# EAGLE design Controller (EAGLE 9.0.0)
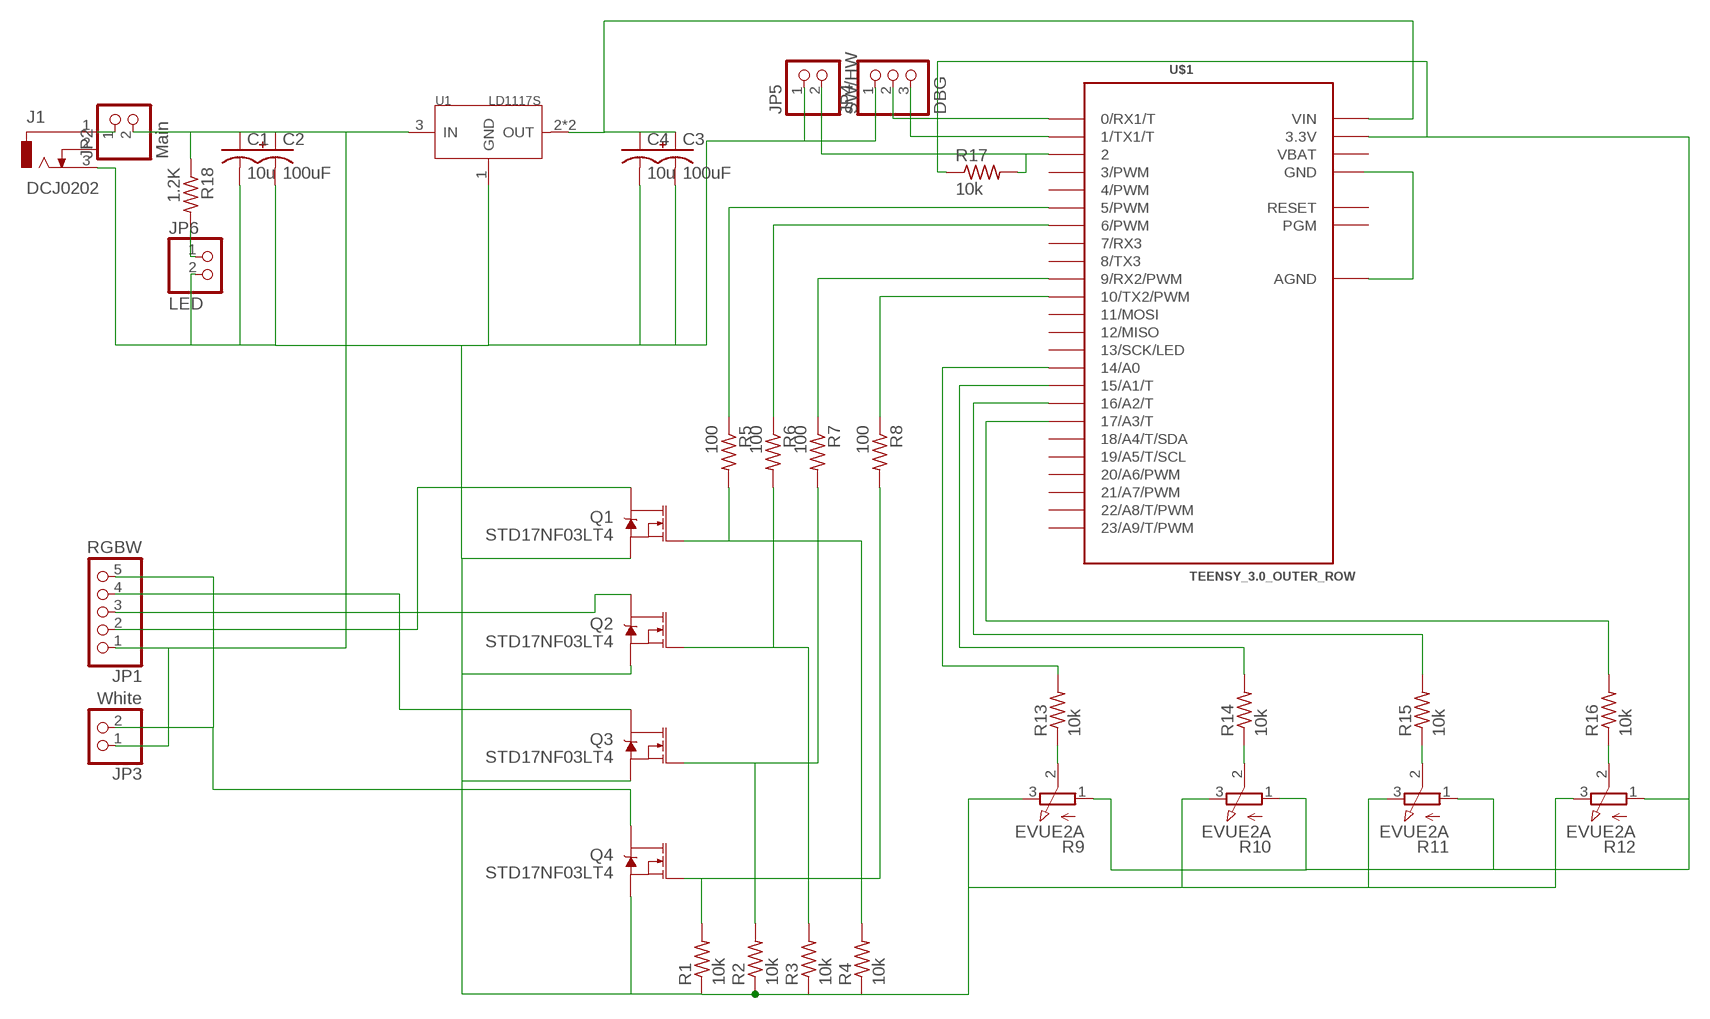
[diagram p0: schematic, sheet 1]

## Parts
C1  10u  ADAFRUIT_C-USC0805  [ADAFRUIT_C0805]
C2  100uF  RCL_CPOL-USTT2D6  [RCL_TT2D6]
C3  100uF  RCL_CPOL-USTT2D6  [RCL_TT2D6]
C4  10u  ADAFRUIT_C-USC0805  [ADAFRUIT_C0805]
J1  DCJ0202  [DCJ0202]
JP1  RGBW  PINHD-1X5/90  [1X05/90]
JP2  Main  PINHD-1X2  [1X02]
JP3  White  PINHD-1X2/90  [1X02/90]
JP4  DBG  PINHD-1X3/90  [1X03/90]
JP5  SW/HW  PINHD-1X2  [1X02]
JP6  LED  PINHD-1X2  [1X02]
Q1  STD17NF03LT4  MOSFET-NCH-FDD8780  [DPAK]
Q2  STD17NF03LT4  MOSFET-NCH-FDD8780  [DPAK]
Q3  STD17NF03LT4  MOSFET-NCH-FDD8780  [DPAK]
Q4  STD17NF03LT4  MOSFET-NCH-FDD8780  [DPAK]
R1  10k  R-US_R0805  [R0805]
R2  10k  R-US_R0805  [R0805]
R3  10k  R-US_R0805  [R0805]
R4  10k  R-US_R0805  [R0805]
R5  100  R-US_R0805  [R0805]
R6  100  R-US_R0805  [R0805]
R7  100  R-US_R0805  [R0805]
R8  100  R-US_R0805  [R0805]
R9  EVUE2A  [EVUE]
R10  EVUE2A  [EVUE]
R11  EVUE2A  [EVUE]
R12  EVUE2A  [EVUE]
R13  10k  R-US_R0805  [R0805]
R14  10k  R-US_R0805  [R0805]
R15  10k  R-US_R0805  [R0805]
R16  10k  R-US_R0805  [R0805]
R17  10k  R-US_R0805  [R0805]
R18  1.2K  R-US_R0805  [R0805]
U1  LD1117S  [SOT-223]
U$1  TEENSY_3.0_OUTER_ROW  [TEENSY_3.0-3.2&LC_OUTER_ROW]

## Nets
GND: C1.2 C2.- C3.- C4.2 J1.3 JP4.1 JP5.1 JP6.2 Q1.3(S) Q2.3(S) Q3.3(S) Q4.3(S) R1.1 R2.1 R3.1 R4.1 R9.3(E) R10.3(E) R11.3(E) R12.3(E) U1.1(GND)
N$1 [LED_Power]: C1.1 C2.+ JP1.1 JP2.2 JP3.1 R18.1 U1.3(IN)
N$2 [3.3vPower]: C3.+ C4.1 U1.2(OUT) U1.TER(OUT) U$1.VIN
N$3: R5.1 U$1.5(5/PWM)
N$4: Q4.1(G) R1.2 R8.2
N$5: Q3.1(G) R2.2 R7.2
N$6: Q2.1(G) R3.2 R6.2
N$7: Q1.1(G) R4.2 R5.2
N$8: R6.1 U$1.6(6/PWM)
N$9: R7.1 U$1.9(9/RX2/PWM)
N$10: R8.1 U$1.10(10/TX2/PWM)
N$11: R9.2(S) R13.1
N$12 [LED_Power]: JP1.2 Q1.4(D)
N$13 [LED_Power]: JP1.3 Q2.4(D)
N$14 [LED_Power]: JP1.4 Q3.4(D)
N$15 [LED_Power]: JP1.5 JP3.2 Q4.4(D)
N$16 [LED_Power]: J1.1 JP2.1
N$17: R10.2(S) R14.1
N$18: R11.2(S) R15.1
N$19: R12.2(S) R16.1
N$20: R9.1(A) R10.1(A) R11.1(A) R12.1(A) R17.1 U$1.3.3V U$1.3.3V1(3.3V)
N$21: R13.2 U$1.14/A0
N$22: R14.2 U$1.15/A1(15/A1/T)
N$23: R15.2 U$1.16/A2(16/A2/T)
N$24: R16.2 U$1.17/A3(17/A3/T)
N$25: U$1.AGND
N$26: JP5.2 R17.2 U$1.2
N$27: JP4.2 U$1.0(0/RX1/T)
N$28: JP4.3 U$1.1(1/TX1/T)
N$29: JP6.1 R18.2
Unconnected: J1.2 U$1.3(3/PWM) U$1.4(4/PWM) U$1.7(7/RX3) U$1.8(8/TX3) U$1.11(11/MOSI) U$1.12(12/MISO) U$1.13(13/SCK/LED) U$1.18/A4(18/A4/T/SDA) U$1.19/A5(19/A5/T/SCL) U$1.20/A6(20/A6/PWM) U$1.21/A7(21/A7/PWM) U$1.22/A8(22/A8/T/PWM) U$1.23/A9(23/A9/T/PWM) U$1.PGM U$1.RESET/DAC(RESET)

## Power pins joined to a net without a drawn wire
GND: U$1.GND U$1.GND1(GND)
VBAT: U$1.VBAT

## Library data of the parts
C1 C4 = schematic:ADAFRUIT_C-US: CAPACITOR, American symbol
C2 C3 = schematic:RCL_CPOL-US: POLARIZED CAPACITOR, American symbol
J1 = con-jack:DCJ0202: DC POWER JACK Source: DCJ0202.pdf; OC_FARNELL: unknown; OC_NEWARK: unknown
JP1 = pinhead:PINHD-1X5: PIN HEADER
JP2 JP3 JP5 JP6 = pinhead:PINHD-1X2: PIN HEADER
JP4 = pinhead:PINHD-1X3: PIN HEADER
Q1-Q4 = SparkFun-DiscreteSemi:MOSFET-NCH: N-channel MOSFETs Voltage controlled devices that allow control of high current outputs. SparkFun Products: SparkFun OpenScale <https://www.sparkfun.com/products/13261> SparkFun Digital Sandbox <https://www.sparkfun.com/products/12651> SparkFun Monster Moto Shield <https://www.sparkfun.com/products/10182> SparkFun MOSFET Power Controller <https://www.sparkfun.com/products/11214>; PROD_ID: TRANS-09984; VALUE: 35A/25V/8.5mΩ
R1-R8 R13-R18 = rcl:R-US_: RESISTOR, American symbol
R9-R12 = pot:EVU: 9 mm Square Rotary Potentiometers Source: Panasonic
U1 = IC:LD1117: Low Drop Fixed And Adjustable Positive Voltage Regulators http://www.datasheetcatalog.org/datasheet/SGSThomsonMicroelectronics/mXuqtqv.pdf
U$1 = Teensy_3_and_LC_Series_Boards_v1.4:TEENSY_3.0_OUTER_ROW: Basic Teensy 3.0 with none of the 'inner' pins enabled. See 'DIL+4', and other packages for additional pin holes, as needed.

## Net classes
2 LED_Power: width 2.032 mm, drill 0.508 mm, clearance 0.127 mm
3 3.3vPower: width 0.508 mm

## Board
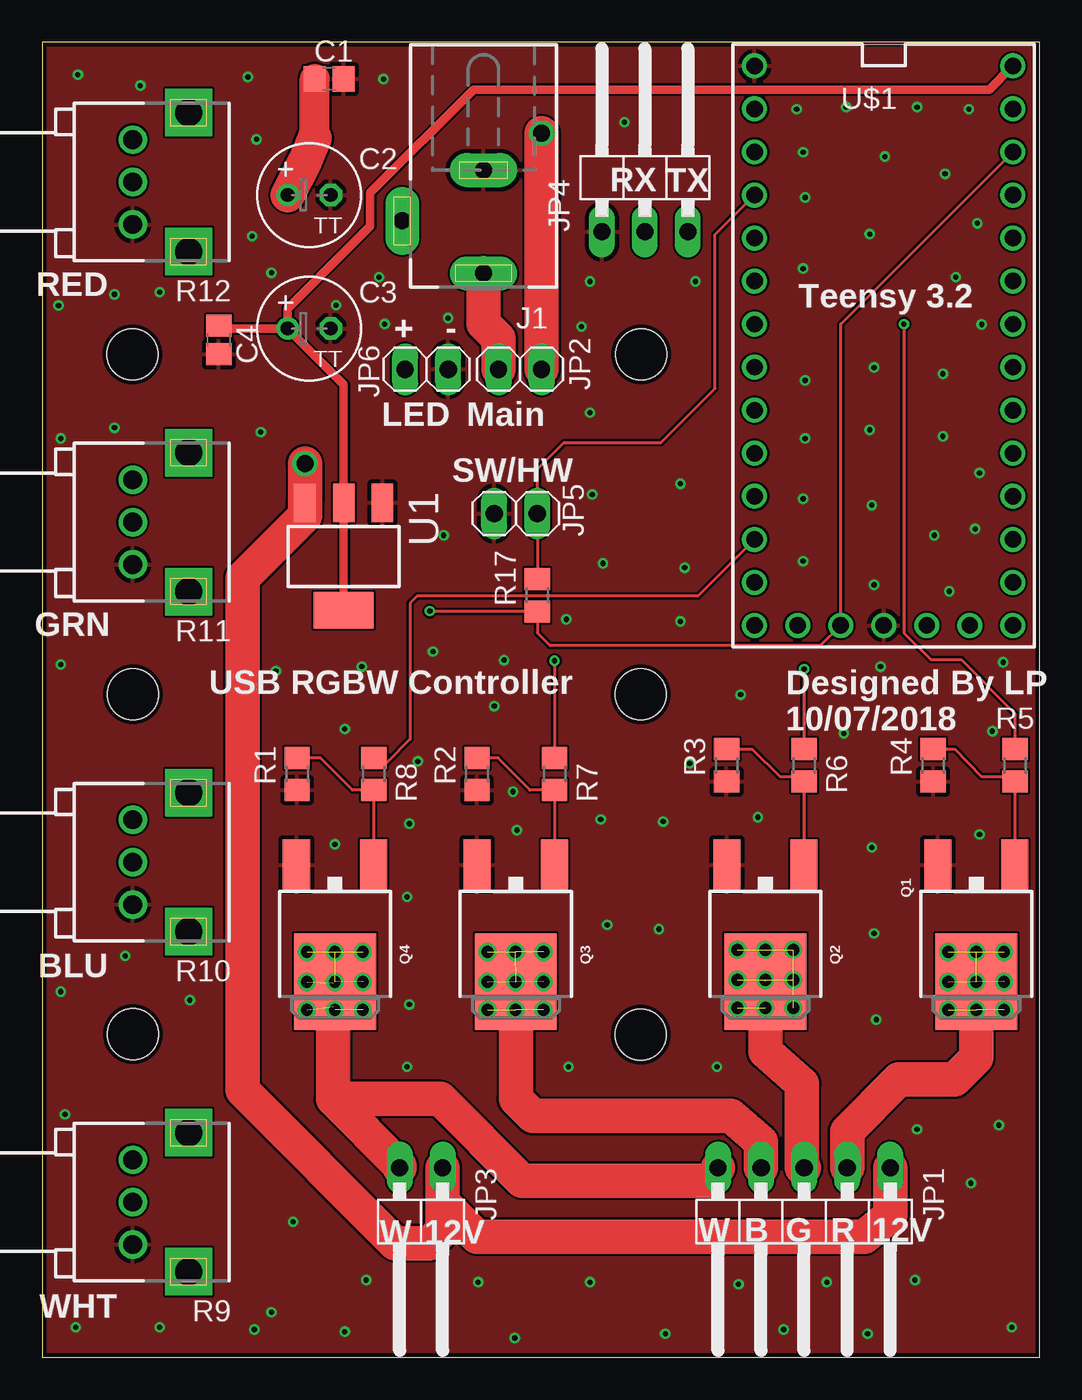
[diagram p1: board, top side]
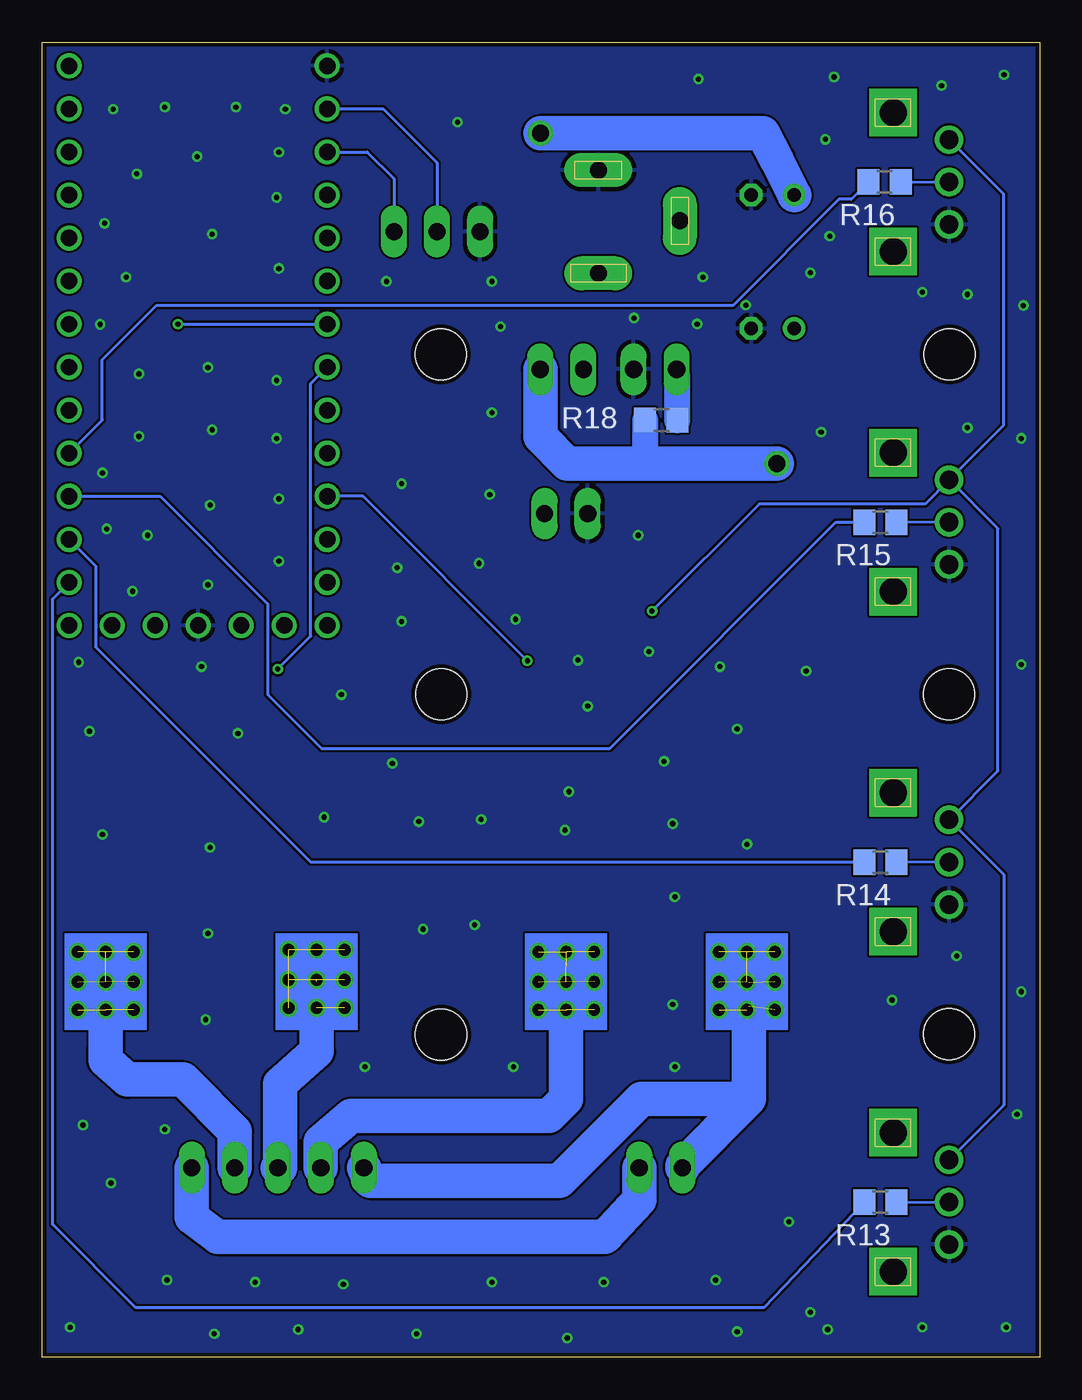
[diagram p2: board, bottom side, seen from below]

Size 58.85 x 77.59 mm. Coordinates in mm from the lower left corner, seen from the top.
Outline: 0,0 58.85,0 58.85,77.59 0,77.59 0,0
Copper layers (1*16): Top 0.035mm / dielectric 1.5mm / Bottom 0.035mm
Design rules "LP_PCBOrder": minimum track width 5mil, minimum drill 12mil, track to track 5mil, track to pad 5mil, pad to pad 5mil, via to via 5mil, smd to smd 0mil, copper to edge 10mil, drill to drill 10mil, minimum pad ring 10mil, minimum via ring 6mil, stop-mask expansion 2mil, vias tented up to drill 17mil, thermal gap 10mil
Holes 3 mm at 5.31,59.18 5.33,39.12 5.33,19.05 35.33,59.18 35.31,39.11 35.32,19.03

### Footprints (pad centres in the part's own frame; a part is rotated, then mirrored left to right if it is on the bottom)
ADAFRUIT_C0805 = smd 1.3 x 1.5: 1 -0.85,0; 2 0.85,0
RCL_TT2D6 = drill 0.813: + -1.27,0 | drill 0.813 octagon: - 1.27,0
DCJ0202 = drill 1 pad 2 long: 1 0,3.1; 2 4.8,0; 3 0,-3
1X05/90 = drill 1.016 long: 1 -5.08,-3.81; 2 -2.54,-3.81; 3 0,-3.81; 4 2.54,-3.81; 5 5.08,-3.81
1X02 = drill 1.016 long: 1 -1.27,0; 2 1.27,0
1X02/90 = drill 1.016 long: 1 -1.27,-3.81; 2 1.27,-3.81
1X03/90 = drill 1.016 long: 1 -2.54,-3.81; 2 0,-3.81; 3 2.54,-3.81
DPAK = smd 1.6 x 3: 1 -2.28,-5.31; 3 2.28,-5.31 | smd 4.826 x 5.715: 4 0,1.588
R0805 = smd 1.3 x 1.5: 1 -0.95,0; 2 0.95,0
EVUE = drill 1.1 pad 1.676: 1 0,-2.5; 2 0,0; 3 0,2.5 | drill 1.6 pad 2.8 square: M1 -3.3,4.1; M2 -3.3,-4.1
SOT-223 = smd 1.27 x 2.286: 1 -2.286,-3.175; 2 0,-3.175; 3 2.286,-3.175 | smd 3.556 x 2.159: TER 0,3.175
TEENSY_3.0-3.2&LC_OUTER_ROW = drill 0.965: 0 -7.62,13.97; 1 -7.62,11.43; 2 -7.62,8.89; 3 -7.62,6.35; 3.3V 7.62,11.43; 3.3V1 -2.54,-16.51; 4 -7.62,3.81; 5 -7.62,1.27; 6 -7.62,-1.27; 7 -7.62,-3.81; 8 -7.62,-6.35; 9 -7.62,-8.89; 10 -7.62,-11.43; 11 -7.62,-13.97; 12 -7.62,-16.51; 13 7.62,-16.51; 14/A0 7.62,-13.97; 15/A1 7.62,-11.43; 16/A2 7.62,-8.89; 17/A3 7.62,-6.35; 18/A4 7.62,-3.81; 19/A5 7.62,-1.27; 20/A6 7.62,1.27; 21/A7 7.62,3.81; 22/A8 7.62,6.35; 23/A9 7.62,8.89; AGND 7.62,13.97; GND -7.62,16.51; GND1 0,-16.51; PGM 2.54,-16.51; RESET/DAC 5.08,-16.51; VBAT -5.08,-16.51; VIN 7.62,16.51

### Placement (x,y rotation side)
C1  16.93,75.44 0 top
C2  15.75,68.58 0 top
C3  15.75,60.71 0 top
C4  10.41,60.03 270 top
J1  26.04,67.06 180 top
JP1  44.96,7.37 180 top
JP2  28.19,58.29 0 top
JP3  22.35,7.37 180 top
JP4  35.56,70.23 0 top
JP5  27.94,49.78 0 top
JP6  22.68,58.29 0 top
Q1  55.12,23.75 180 top
Q2  42.67,23.75 180 top
Q3  27.94,23.75 180 top
Q4  17.27,23.75 180 top
R1  15.04,34.42 90 top
R2  25.65,34.42 90 top
R3  40.39,34.93 90 top
R4  52.58,34.93 90 top
R5  57.4,34.93 270 top
R6  44.96,34.93 270 top
R7  30.23,34.42 270 top
R8  19.56,34.42 270 top
R9  5.33,9.14 180 top
R10  5.33,29.21 180 top
R11  5.33,49.28 180 top
R12  5.33,69.34 180 top
R13  9.4,9.14 180 bottom
R14  9.4,29.21 180 bottom
R15  9.4,49.28 180 bottom
R16  9.14,69.34 180 bottom
R17  29.21,44.96 90 top
R18  22.33,55.3 0 bottom
U1  17.78,47.24 180 top
U$1  49.66,59.69 0 top

### Tracks (layer width: path | path; a pad name or v marks a point on that pad's centre or on a via)
GND  (via drill 0.3 pad 0.61)
  Top 0.178: 52.58,29.89 52.84,29.63 | R3.1 40.39,34.28 | 25.65,29.64 25.66,29.63 | 14.99,29.76 Q4.3
  other vias: 26.67,38.42 38.2,35.04 6.92,62.85 17.27,30.26 27.78,33.36 2.1,75.67 5.78,75.04 12.13,75.55 12.64,71.86 12.38,66.15 13.53,63.99 4.25,62.72 0.95,62.06 1.08,54.21 4.25,54.84 12.89,54.59 17.34,62.08 19.88,63.73 23.94,61.32 20.21,60.97 13.78,40.49 18.86,40.75 23.05,41.64 27.24,41.13 30.92,43.54 33.08,46.84 32.45,50.91 37.66,51.54 32.32,55.73 31.81,60.81 38.54,63.48 32.32,63.48 34.35,72.88 20.13,75.42 22.16,35.16 17.84,37.06 28,31.1 42.23,31.86 36.64,31.6 32.96,31.73 48.96,30.08 47.31,36.81 49.47,40.75 56.71,41 55.31,30.84 56.07,36.94 49.21,19.92 36.39,25.25 33.34,25.51 21.53,27.16 21.65,20.81 8.7,21.06 4.89,23.68 1.08,21.57 1.33,14.33 1.97,1.76 6.92,1.76 12.51,1.63 41.08,4.3 46.29,4.43 51.5,4.55 49.09,25 21.53,17.13 31.05,17.13 39.81,17.13 1.08,40.87 23.69,48.49 41.21,39.1 54.67,73.64 51.63,73.77 47.43,73.77 44.51,73.64 49.72,70.85 45.02,68.43 55.18,66.91 48.83,66.27 44.89,64.24 53.91,63.73 55.44,60.94 53.15,58.02 49.09,58.4 45.02,57.64 45.02,54.21 48.83,54.72 53.15,54.34 55.31,52.18 55.05,48.88 48.96,50.27 44.89,50.65 44.89,46.97 49.09,45.57 53.53,45.19 52.64,48.49 53.28,69.83 44.89,71.1 37.91,46.59 37.66,43.41 13.53,2.65 14.8,7.98 17.84,1.5 19.11,4.55 25.72,4.43 27.88,1.12 32.32,4.43 36.77,1.38 43.75,1.63 48.7,1.38 57.21,1.76 54.8,10.27 56.45,13.7 51.63,13.44 21.65,31.48
  pour Bottom: 0,77.47 58.8,77.47 58.8,0 0,0
  pour Top: 0,77.47 0,0 58.8,0 58.8,77.47
N$1  (via drill 1 pad 0.81)
  Top 1.778: 16.08,71.93 C1.1
  Top 2.032: C2.+ 15.49,70.58 16.08,71.93 | v29.46,72.22 JP2.2 | v15.49,52.73 U1.3 15.49,49.66 11.81,45.97 11.81,15.75 20.83,6.73 22.86,6.73 23.62,7.49 JP3.1 | 23.62,9.02 JP3.1 | JP3.1 23.62,9.14 25.65,7.11 48.51,7.11 50.04,8.38 JP1.1
  Bottom 1.524: R18.1 23.28,52.79 23.22,52.73
  Bottom 2.032: JP1.1 50.04,8.26 48.51,7.11 25.65,7.11 23.62,9.27 JP3.1 | C2.+ 15.49,70.64 16.32,72.22 v29.46,72.22 | JP2.2 29.46,54.32 27.88,52.73 23.22,52.73 v15.49,52.73
N$2
  Top 0.508: C3.+ 17.78,57.4 U1.2 U1.TER | U$1.VIN 55.88,74.8 25.45,74.8 19.36,68.71 19.36,66.75 14.48,61.87 C3.+ | C3.+ 10.59,60.71 C4.1
N$3  (via drill 0.3 pad 0.61)
  Top 0.178: v50.85,60.96 50.85,42.74 52.44,41.15 54.23,41.15 57.4,37.98 R5.1
  Bottom 0.178: v50.85,60.96 U$1.5
N$4
  Top 0.178: R1.2 16.41,35.37 18.29,33.46 R8.2 19.56,29.64 19.55,29.63 Q4.1
N$5
  Top 0.178: R2.2 26.91,35.37 28.77,33.46 R7.2 30.23,29.64 30.22,29.63 Q3.1
N$6
  Top 0.178: Q2.1 44.95,29.63 44.96,29.64 R6.2 44.94,34.25 43.54,34.25 41.88,35.88 R3.2
N$7
  Top 0.178: Q1.1 57.4,29.63 57.4,29.64 R5.2 57.4,34.24 57.38,34.27 55.42,34.27 53.86,35.88 R4.2
N$8  (via drill 0.3 pad 0.61)
  Top 0.178: v44.96,40.61 R6.1
  Bottom 0.178: v44.96,40.61 43.02,42.55 43.02,57.44 U$1.6
N$9  (via drill 0.3 pad 0.61)
  Top 0.178: v30.23,41.09 R7.1
  Bottom 0.178: v30.23,41.09 39.94,50.8 U$1.9
N$10
  Top 0.178: U$1.10 38.68,44.9 22.11,44.9 21.71,44.5 21.71,36.47 20.31,35.07 R8.1
N$11
  Bottom 0.152: R13.1 R9.2
N$12  (via drill 0.7 pad 0.81)  (8 unrouted)
  Top 2.032: JP1.2 47.5,13.34 50.55,16.38 53.85,16.38 55.12,17.65 Q1.4
  Bottom 2.032: JP1.2 47.5,13.34 50.55,16.38 53.85,16.38 55.12,17.53 | 55.12,17.53 55.12,18.16 | v55.11,20.48 55.11,17.54 55.12,17.53
  other vias: 53.46,23.91 55.11,23.91 56.76,23.91 53.46,22.14 55.11,22.14 56.76,22.14 53.46,20.49 56.76,20.49
N$13  (via drill 0.7 pad 0.81)  (8 unrouted)
  Top 2.032: Q2.4 42.67,18.03 44.83,16.13 44.83,11.18 JP1.3
  Bottom 2.032: JP1.3 44.83,11.18 44.83,16.13 42.66,18.04 v42.66,20.61
  other vias: 41.01,24.04 42.66,24.04 44.31,24.04 41.01,22.26 42.66,22.26 44.31,22.26 41.01,20.61 44.31,20.61
N$14  (via drill 0.7 pad 0.81)  (8 unrouted)
  Top 2.032: Q3.4 27.94,15.24 28.96,14.22 40.64,14.22 42.42,12.7 JP1.4
  Bottom 2.032: JP1.4 42.42,12.7 40.64,14.22 28.96,14.22 27.94,15.24 27.94,20.48 v27.93,20.48
  other vias: 26.28,23.91 27.93,23.91 29.58,23.91 26.28,22.14 27.93,22.14 29.58,22.14 26.28,20.49 29.58,20.49
N$15  (via drill 0.7 pad 0.81)  (8 unrouted)
  Top 2.032: JP3.2 21.08,11.3 17.14,15.24 | Q4.4 17.14,22.1 17.14,15.24 | JP1.5 39.5,10.41 28.32,10.41 23.49,15.24 17.14,15.24
  Bottom 2.032: JP1.5 39.5,10.41 28.32,10.41 23.49,15.24 17.14,15.24 | 17.14,15.24 17.14,20.7 v17.27,20.48 v17.26,20.48 | 17.14,15.24 21.08,11.3 JP3.2
  other vias: 15.61,23.91 17.26,23.91 18.91,23.91 15.61,22.14 17.26,22.14 18.91,22.14 15.61,20.49 18.91,20.49
N$16
  Top 2.032: J1.1 26.04,60.98 26.92,60.1 JP2.1
N$17
  Bottom 0.152: R14.1 R10.2
N$18
  Bottom 0.152: R15.1 R11.2
N$19
  Bottom 0.152: R16.1 R12.2
N$20  (via drill 0.3 pad 0.61)
  Top 0.178: v22.87,44.03 22.92,44 R17.1 29.21,42.73 29.97,41.98 45.92,41.98 U$1.3.3V1 47.12,60.96 U$1.3.3V
  Bottom 0.178: R11.1 6.75,50.36 16.54,50.36 v22.87,44.03 | R9.1 2.12,14.86 2.12,28.49 R10.1 2.45,34.59 2.45,48.89 R11.1 | R11.1 2.12,54.99 2.12,68.63 R12.1
N$21
  Bottom 0.178: U$1.14/A0 58.26,44.74 58.26,7.84 53.34,2.92 16.27,2.92 R13.2
N$22
  Bottom 0.178: U$1.15/A1 55.72,46.7 55.72,41.91 43.02,29.21 R14.2
N$23
  Bottom 0.178: U$1.16/A2 51.91,50.8 45.55,44.45 45.55,39.1 42.38,35.92 25.36,35.92 12.01,49.28 R15.2
N$24
  Bottom 0.178: U$1.17/A3 55.31,55.31 55.31,58.88 52.13,62.05 19.56,62.05 19.51,62.05 18.1,62.05 11.83,68.33 11.11,68.33 R16.2
N$26
  Top 0.178: R17.2 JP5.2 29.21,52.39 30.8,53.98 36.52,53.98 39.7,57.16 39.7,66.24 U$1.2
N$27
  Bottom 0.178: U$1.0 38.73,73.66 35.56,70.48 JP4.2
N$28
  Bottom 0.178: U$1.1 39.69,71.12 38.1,69.53 JP4.3
N$29
  Bottom 1.524: R18.2 21.38,57.75 JP6.1
(copper drawn outside any net)
  shapes: Bottom area x4

### Text on the board
tPlace: RX | TX | RED | Teensy 3.2 | + | - | LED | Main | SW/HW | GRN | USB RGBW Controller | Designed By LP / 10/07/2018 | BLU | W | 12V | W | B | G | R | 12V | WHT